# Altium schematic sheet Top.SchDoc
size A4; SheetNumber: 1; SheetTotal: 4
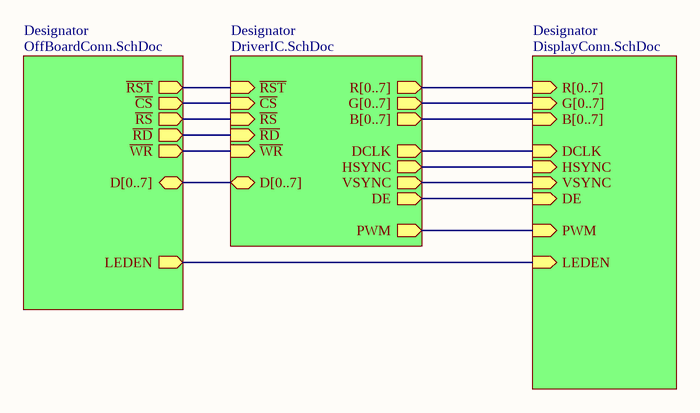
[diagram p0: Top.SchDoc]

## Sub-sheets
Designator = DisplayConn.SchDoc: R[0..7] (in), G[0..7] (in), B[0..7] (in), DCLK (in), HSYNC (in), VSYNC (in), DE (in), PWM (in), LEDEN (in)
Designator = DriverIC.SchDoc: R[0..7] (out), B[0..7] (out), G[0..7] (out), DE (out), VSYNC (out), HSYNC (out), DCLK (out), PWM (out), ~{RST} (in), ~{CS} (in), ~{RS} (in), ~{RD} (in), ~{WR} (in), D[0..7] (bidir)
Designator = OffBoardConn.SchDoc: ~{RST} (out), ~{CS} (out), ~{RS} (out), ~{RD} (out), ~{WR} (out), D[0..7] (bidir), LEDEN (out)

## Nets
(unnamed): sheet Designator/DCLK, sheet Designator/DCLK
(unnamed): sheet Designator/HSYNC, sheet Designator/HSYNC
(unnamed): sheet Designator/VSYNC, sheet Designator/VSYNC
(unnamed): sheet Designator/DE, sheet Designator/DE
(unnamed): sheet Designator/PWM, sheet Designator/PWM
(unnamed): sheet Designator/LEDEN, sheet Designator/LEDEN
(unnamed): sheet Designator/~{RST}, sheet Designator/~{RST}
(unnamed): sheet Designator/~{CS}, sheet Designator/~{CS}
(unnamed): sheet Designator/~{RS}, sheet Designator/~{RS}
(unnamed): sheet Designator/~{RD}, sheet Designator/~{RD}
(unnamed): sheet Designator/~{WR}, sheet Designator/~{WR}